# Altium project TouchButton_Electrode.PrjPcb
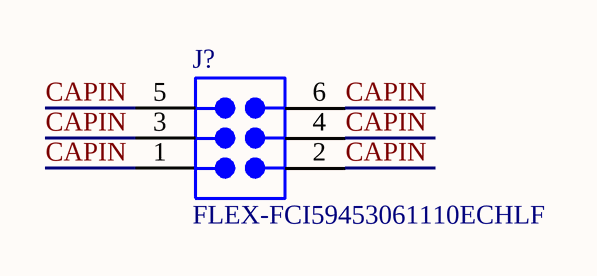
[diagram p0: Touch_1Button.SchDoc]
3 sheets, 6 parts. Net scope: global (net labels, ports and power ports of the same name join across sheets).
Board files: TouchButton_Electrode.PcbDoc, Touch_1Button_Flex.PcbDoc, Touch_6Buttons_Wheel_Flex.PcbDoc, Touch_MediumWheel_Flex.PcbDoc, Touch_1B_6BWheel_MWheel.PcbDoc
Sheets:
  Touch_1Button.SchDoc
  Touch_6Buttons.SchDoc
  Touch_MediumWheel.SchDoc

## Sheet Touch_1Button.SchDoc: Touch button electrode
size B; Author: Sebastien Gelinas; Organization: SmartHalo; Address1: 5445 de Gaspé; Address2: Montréal, QC; Address3: Canada; Address4: H2T 3B2; Revision: 1; SheetNumber: 1; SheetTotal: 1

### Parts
(Parts that share a designator on the sheet are numbered #1, #2 ... from top to bottom, then left to right.)
J?#1  FLEX-FCI59453061110ECHLF  [FLEX-FCI5945306111CHLF]  (no BOM)

### Nets
CAPIN: J?#1.1 J?#1.2 J?#1.3 J?#1.4 J?#1.5 J?#1.6

### Notes on the sheet
- Title
- Size:
- Date:
- B
- Author:
- Time:
- Sheet
- Revision:
- of
- File:

### Library data of the parts
J?#1 = FLEX-FCI59453061110ECHLF: Flex Connector, to connect to FPC, 0.5 mm pitch, 6 contacts

## Sheet Touch_6Buttons.SchDoc: Touch button electrode
size B; Author: Sebastien Gelinas; Organization: SmartHalo; Address1: 5445 de Gaspé; Address2: Montréal, QC; Address3: Canada; Address4: H2T 3B2; Revision: 1; SheetNumber: 1; SheetTotal: 1
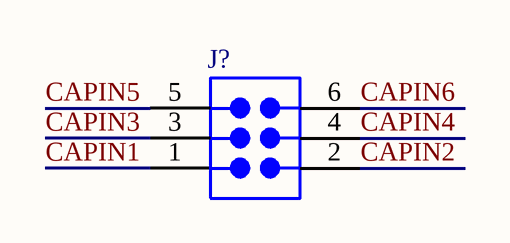
[diagram p1: Touch_6Buttons.SchDoc]

### Parts
(Parts that share a designator on the sheet are numbered #1, #2 ... from top to bottom, then left to right.)
J?#2  FLEX-FCI59453061110ECHLF  [FLEX-FCI5945306111CHLF]  (value not drawn)  (no BOM)

### Nets
CAPIN1: J?#2.1
CAPIN2: J?#2.2
CAPIN3: J?#2.3
CAPIN4: J?#2.4
CAPIN5: J?#2.5
CAPIN6: J?#2.6

### Notes on the sheet
- Title
- Size:
- Date:
- B
- Author:
- Time:
- Sheet
- Revision:
- of
- File:

### Library data of the parts
J?#2 = FLEX-FCI59453061110ECHLF: as J?#1 on sheet Touch_1Button

## Sheet Touch_MediumWheel.SchDoc
size B; Organization: SmartHalo; Address1: 5445 de Gaspé; Address2: Montréal, QC; Address3: Canada; Address4: H2T 3B2
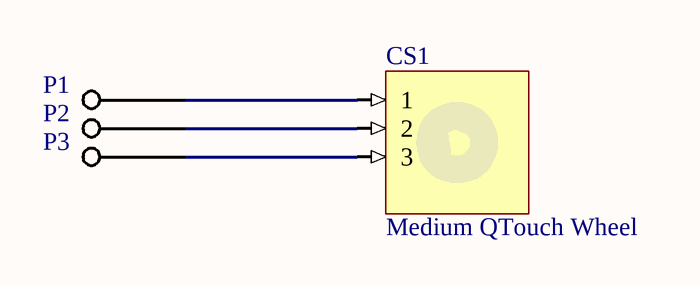
[diagram p2: Touch_MediumWheel.SchDoc]

### Parts
CS1  Medium QTouch Wheel  (no BOM)
P1  PAD_27x27MILS  [PAD_27x27MILS]  (value not drawn)  (no BOM)
P2  PAD_27x27MILS  [PAD_27x27MILS]  (value not drawn)  (no BOM)
P3  PAD_27x27MILS  [PAD_27x27MILS]  (value not drawn)  (no BOM)

### Nets
NetCS1_1: CS1.1 P1.1
NetCS1_2: CS1.2 P2.1
NetCS1_3: CS1.3 P3.1

### Notes on the sheet
- Title
- Size:
- Date:
- B
- Author:
- Time:
- Sheet
- Revision:
- of
- File:

### Library data of the parts
CS1 = MediumQTouchWheel: ConfiguratorName: ATMEL_TOUCH; ConfigurationParameters: {}__sensorid[8]{}odiameter[20]{}idiameter[10]{}gapthickness[0.3]{}
P1-P3 = PAD_27x27MILS: 27 x 27 mils PAD connection